# EasyEDA Pro project ProPrj_Filter_2024-12-27.epro

# Schematic Filter
Board Name: Filter; Create Date: 2024-12-21; Page Name: Filter; Project Name: Filter; Schematic Name: Filter; Update Date: 2024-12-21; Address1: *; Address2: *; Address3: *; Address4: *; Application_BuildNumber: *; ApprovedBy: *; Author: *; CheckedBy: *; CompanyName: *; CurrentDate: *; CurrentTime: *; Date: *; DocumentFullPathAndName: *; DocumentName: *; DocumentNumber: *; DrawnBy: *; Engineer: *; ImagePath: *; ModifiedDate: *; Organization: *; ProjectName: *; Revision: *; Rule: *; SPICEModelCacheQSZUGKFO: &lt;root&gt;  &lt;DocumentId&gt;QSZUGKFO&lt;/DocumentId&gt;&lt;/root&gt;; SheetNumber: 1; SheetTotal: 2; Time: *; Title: *
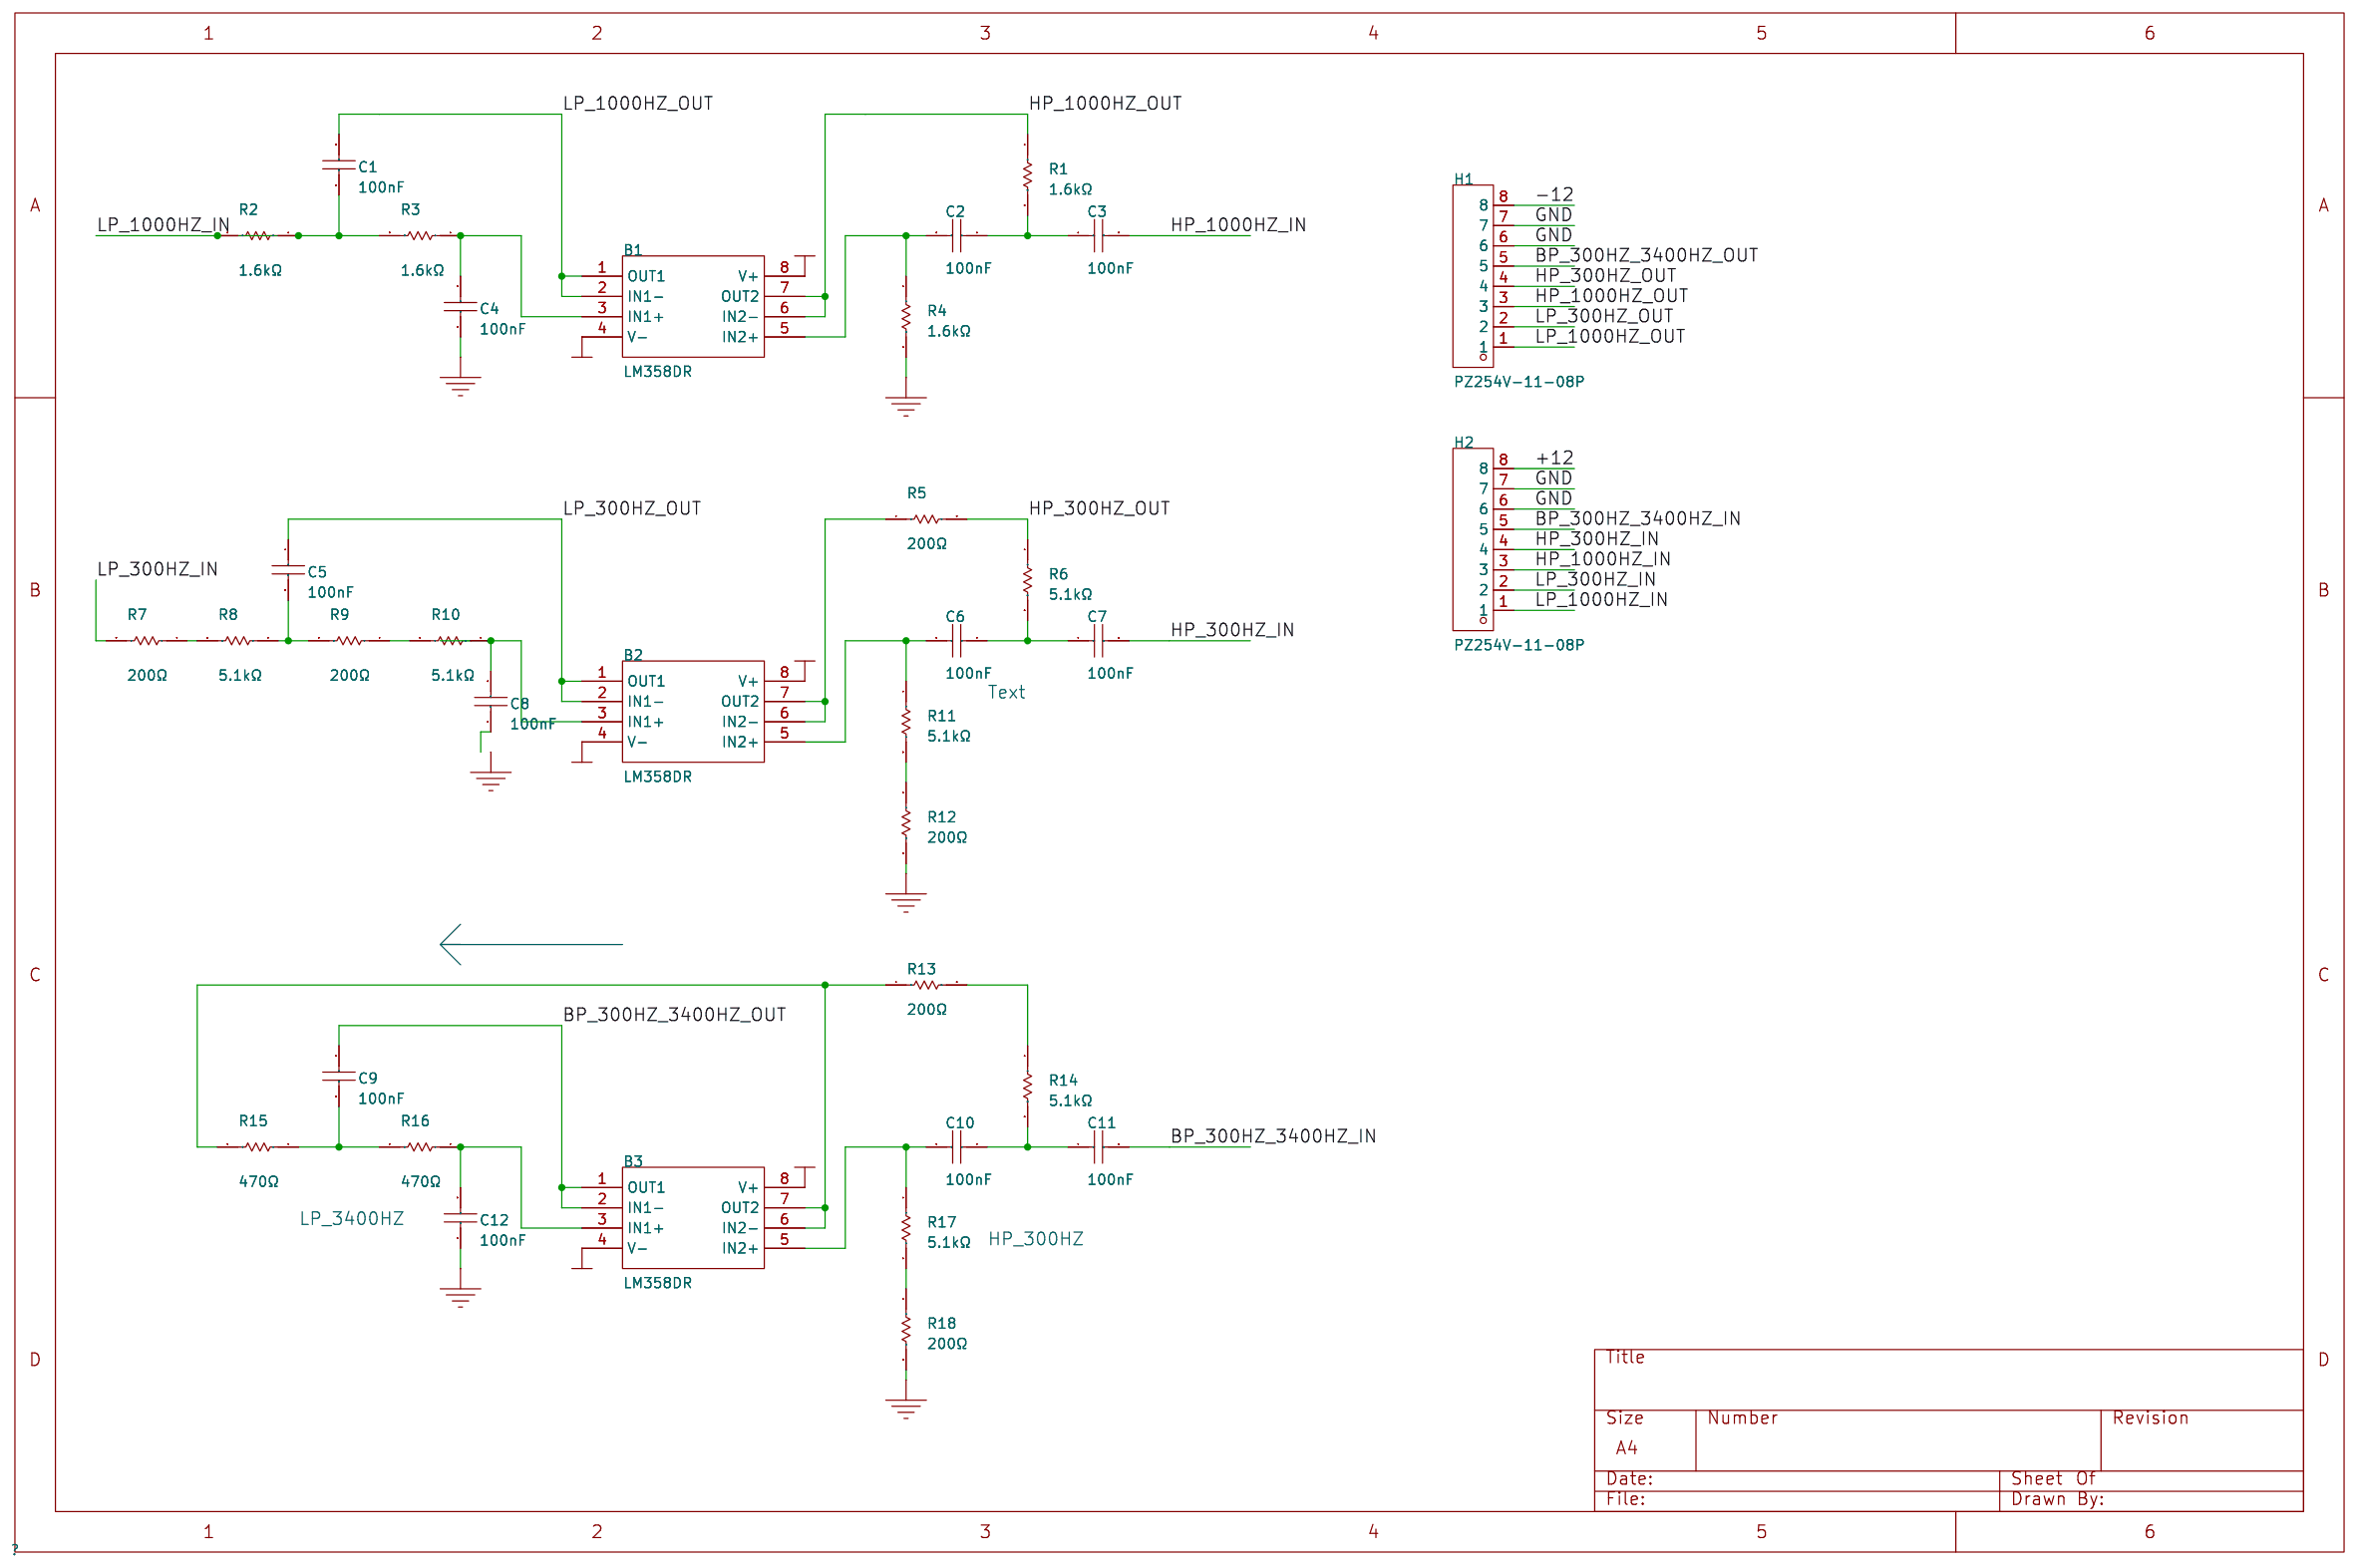
[diagram p0: schematic sheet]

## Parts
B1  LM358DR  [SOIC-8_L5.0-W4.0-P1.27-LS6.0-BL]
B2  LM358DR  [SOIC-8_L5.0-W4.0-P1.27-LS6.0-BL]
B3  LM358DR  [SOIC-8_L5.0-W4.0-P1.27-LS6.0-BL]
C1  100nF  [C0805]
C2  100nF  [C0805]
C3  100nF  [C0805]
C4  100nF  [C0805]
C5  100nF  [C0805]
C6  100nF  [C0805]
C7  100nF  [C0805]
C8  100nF  [C0805]
C9  100nF  [C0805]
C10  100nF  [C0805]
C11  100nF  [C0805]
C12  100nF  [C0805]
H1  PZ254V-11-08P  [HDR-TH_8P-P2.54-V-M]
H2  PZ254V-11-08P  [HDR-TH_8P-P2.54-V-M]
R1  1.6kΩ  [R0805]
R2  1.6kΩ  [R0805]
R3  1.6kΩ  [R0805]
R4  1.6kΩ  [R0805]
R5  200Ω  [R0805]
R6  5.1kΩ  [R0805]
R7  200Ω  [R0805]
R8  5.1kΩ  [R0805]
R9  200Ω  [R0805]
R10  5.1kΩ  [R0805]
R11  5.1kΩ  [R0805]
R12  200Ω  [R0805]
R13  200Ω  [R0805]
R14  5.1kΩ  [R0805]
R15  470Ω  [R0805]
R16  470Ω  [R0805]
R17  5.1kΩ  [R0805]
R18  200Ω  [R0805]

## Library data of the parts
B1-B3 = LM358DR: 放大器数:双路;增益带宽积(GBP):700kHz;压摆率(SR):0.3V/us;输入偏置电流(Ib):20nA;; LCSC Part Name: 行业标准双路运算放大器; Supplier Part: C5423; Manufacturer: TI(德州仪器); Supplier Footprint: SOIC-8; JLCPCB Part Class: Extended Part; Datasheet: https://www.ti.com/cn/lit/gpn/lm358; Supplier: LCSC; Number of Circuits: 双路; Gain Bandwidth Product(GBP): 700kHz; Slew Rate(SR): 0.3V/us; Current - Input Bias(Ib): 20nA; Quiescent Current: 1mA; Output Current: 40mA; Operating Temperature: 0℃~+70℃
C1-C12 = 0805B104J500NT: 容值:100nF;精度:±5%;额定电压:50V;材质(温度系数):X7R;; LCSC Part Name: 100nF ±5% 50V; Supplier Part: C29926; Manufacturer: FH(风华); Supplier Footprint: 0805; JLCPCB Part Class: Extended Part; Datasheet: https://atta.szlcsc.com/upload/public/pdf/source/20200305/C486355_26A10D38EF8C2A5C37091D0039909270.pdf; Supplier: LCSC; Tolerance: ±5%; Voltage Rated: 50V; Temperature Coefficient: X7R
H1 H2 = PZ254V-11-08P: 插针结构:1x8P;间距:2.54mm;行距:-;圆针/方针:方针;安装类型:直插;排数:单排;总PIN位数:8P;额定电流:-;额定电压:-;配合针长度:6mm;塑高:2.5mm;端接针长度:3mm;触头材质:黄铜;触头镀层:-;工作温度范围:-40℃~+105℃;颜色:黑色;; LCSC Part Name: 间距:2.54mm 1x8P 直插 方针; Supplier Part: C492407; Manufacturer: XFCN(兴飞); Supplier Footprint: 插件,P=2.54mm; JLCPCB Part Class: Extended Part; Datasheet: https://atta.szlcsc.com/upload/public/pdf/source/20200309/C492407_83A6FB26A2233368EDB9516968EC6149.pdf; Supplier: LCSC; Pin Structure: 1x8P; Pitch: 2.54mm; Circluar Pins/Square Pins: 方针; Mounting Type: 直插; Number of Rows: 单排; Number of Pins: 8P; Length of Mating Pin: 6mm; Insulation Height: 2.5mm; Length of End Connection Pin: 3mm; Contact Material: 黄铜; Operating Temperature Range: -40℃~+105℃; Color: 黑色
R1-R4 = FRC0805F1601TS: 电阻类型:厚膜电阻;阻值:1.6kΩ;精度:±1%;功率:125mW;最大工作电压:150V;温度系数:±100ppm/℃;; LCSC Part Name: 1.6kΩ ±1% 125mW 厚膜电阻; Supplier Part: C2933328; Manufacturer: FOJAN(富捷); Supplier Footprint: 0805; JLCPCB Part Class: Extended Part; Datasheet: https://atta.szlcsc.com/upload/public/pdf/source/20211221/925EC7D7225764EE0046F22065062C87.pdf; Supplier: LCSC; Type: 厚膜电阻; Tolerance: ±1%; Power(Watts): 125mW; Overload Voltage (Max): 150V; Temperature Coefficient: ±100ppm/℃; Operating Temperature Range: -55℃~+155℃
R5 R7 R9 R12 R13 R18 = 0805W8F2000T5E: 电阻类型:厚膜电阻;阻值:200Ω;精度:±1%;功率:125mW;最大工作电压:150V;温度系数:±100ppm/℃;; LCSC Part Name: 200Ω ±1% 125mW 厚膜电阻; Supplier Part: C17540; Manufacturer: UNI-ROYAL(厚声); Supplier Footprint: 0805; JLCPCB Part Class: Basic Part; Datasheet: https://atta.szlcsc.com/upload/public/pdf/source/20200306/C422600_1E6D84923E4A46A82E41ADD87F860B5C.pdf; Supplier: LCSC; Type: 厚膜电阻; Tolerance: ±1%; Power(Watts): 125mW; Overload Voltage (Max): 150V; Temperature Coefficient: ±100ppm/℃; Operating Temperature Range: -55℃~+155℃
R6 R8 R10 R11 R14 R17 = 0805W8F5101T5E: 电阻类型:厚膜电阻;阻值:5.1kΩ;精度:±1%;功率:125mW;最大工作电压:150V;温度系数:±100ppm/℃;; LCSC Part Name: 5.1kΩ ±1% 125mW 厚膜电阻; Supplier Part: C27834; Manufacturer: UNI-ROYAL(厚声); Supplier Footprint: 0805; JLCPCB Part Class: Basic Part; Datasheet: https://atta.szlcsc.com/upload/public/pdf/source/20200306/C422600_1E6D84923E4A46A82E41ADD87F860B5C.pdf; Supplier: LCSC; Type: 厚膜电阻; Tolerance: ±1%; Power(Watts): 125mW; Overload Voltage (Max): 150V; Temperature Coefficient: ±100ppm/℃; Operating Temperature Range: -55℃~+155℃
R15 R16 = FRC0805J471 TS: 电阻类型:厚膜电阻;阻值:470Ω;精度:±5%;功率:125mW;最大工作电压:150V;温度系数:±100ppm/℃;; LCSC Part Name: 470Ω ±5% 125mW 厚膜电阻; Supplier Part: C2907329; Manufacturer: FOJAN(富捷); Supplier Footprint: 0805; JLCPCB Part Class: Extended Part; Datasheet: https://atta.szlcsc.com/upload/public/pdf/source/20211221/925EC7D7225764EE0046F22065062C87.pdf; Supplier: LCSC; Type: 厚膜电阻; Tolerance: ±5%; Power(Watts): 125mW; Overload Voltage (Max): 150V; Temperature Coefficient: ±100ppm/℃; Operating Temperature Range: -55℃~+155℃

## Nets
GND: C4.1 C8.1 C12.1 H1.6 H1.7 H2.6 H2.7 R4.2 R12.2 R18.2
+12: B1.8(V+) B2.8(V+) B3.8(V+) H2.8
-12: B1.4(V-) B2.4(V-) B3.4(V-) H1.8
BP_300HZ_3400HZ_IN: C11.2 H2.5
BP_300HZ_3400HZ_OUT: B3.1(OUT1) B3.2(IN1-) C9.1 H1.5
HP_300HZ_IN: C7.2 H2.4
HP_300HZ_OUT: H1.4 R5.2 R6.1
HP_1000HZ_IN: C3.2 H2.3
HP_1000HZ_OUT: B1.6(IN2-) B1.7(OUT2) H1.3 R1.1
LP_300HZ_IN: H2.2 R7.2
LP_300HZ_OUT: B2.1(OUT1) B2.2(IN1-) C5.1 H1.2
LP_1000HZ_IN: C1.2 H2.1 R2.1 R2.2 R3.2
LP_1000HZ_OUT: B1.1(OUT1) B1.2(IN1-) C1.1 H1.1
$1N2: B1.3(IN1+) C4.2 R3.1
$1N7: C2.1 C3.1 R1.2
$1N9: B1.5(IN2+) C2.2 R4.1
$1N12: B2.3(IN1+) C8.2 R10.1
$1N17: C6.1 C7.1 R6.2
$1N19: B2.5(IN2+) C6.2 R11.1
$1N22: B3.3(IN1+) C12.2 R16.1
$1N24: R17.2 R18.1
$1N26: C10.1 C11.1 R14.2
$1N28: B3.5(IN2+) C10.2 R17.1
$1N2608: C9.2 R15.1 R16.2
$1N2619: B3.6(IN2-) B3.7(OUT2) R13.1 R15.2
$1N2647: R13.2 R14.1
$1N2735: R11.2 R12.1
$1N2855: B2.6(IN2-) B2.7(OUT2) R5.1
$1N2901: R7.1 R8.2
$1N2936: R9.1 R10.2
$1N2941: C5.2 R8.1 R9.2

## Notes on the sheet
- Text
- LP_3400HZ
- HP_300HZ

# Board PCB1
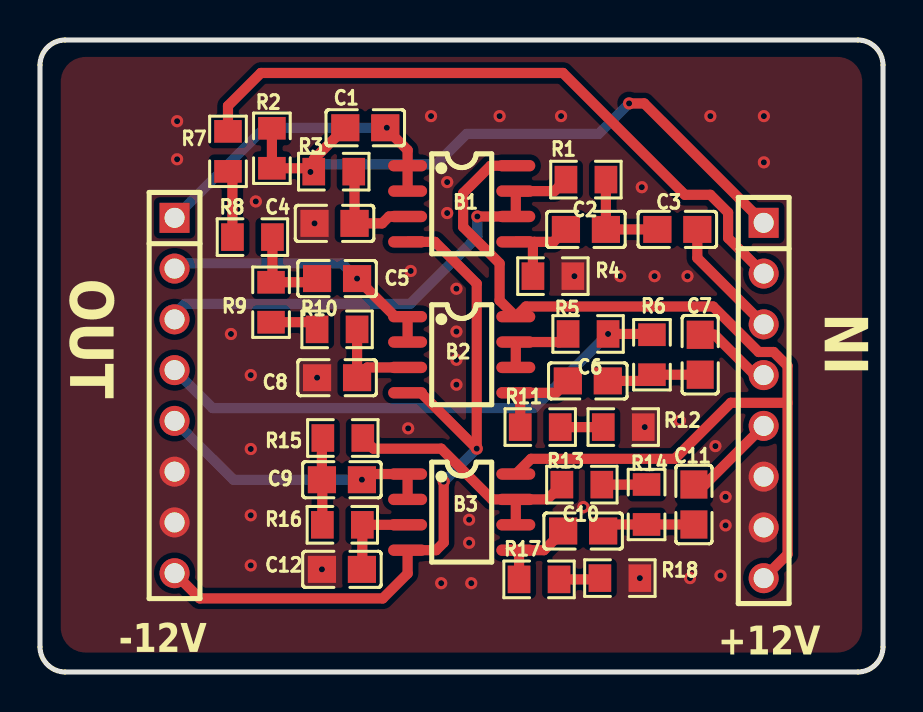
[diagram p1: board, top side]
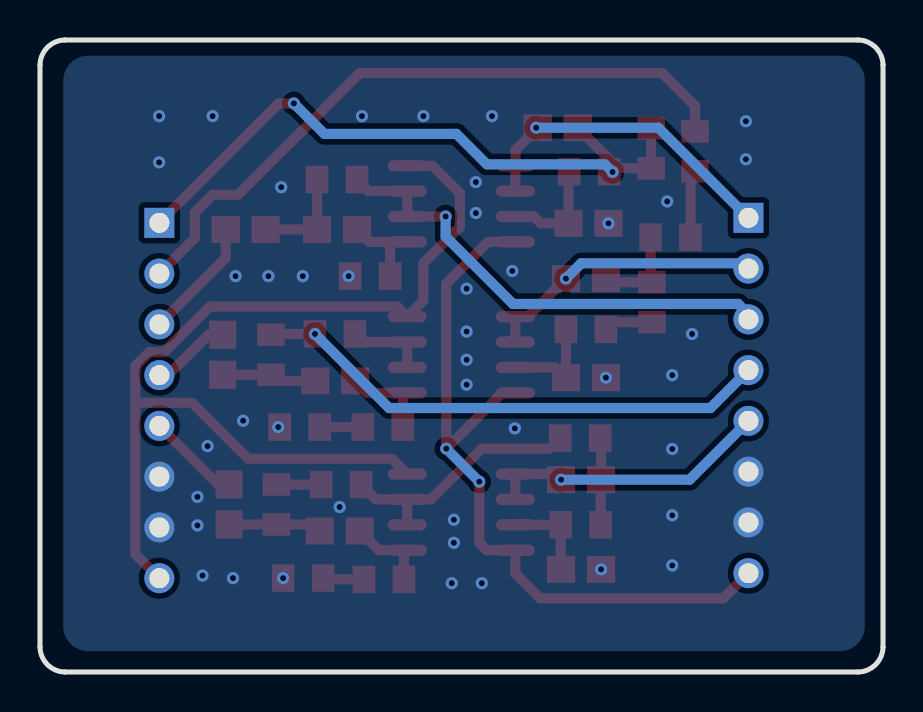
[diagram p2: board, bottom side, seen from below]

Outline 42.16 x 31.62 mm; copper layers: Top Layer, Bottom Layer. Coordinates in mm from the lower left corner of the outline.
Outline path: 0,30.35 0,1.27 arc(0.37,0.37) 1.27,0 40.89,0 arc(41.79,0.37) 42.16,1.27 42.16,30.35 arc(41.79,31.25) 40.89,31.62 1.27,31.62 arc(0.37,31.25) 0,30.35
Stack: Top Layer 0.035mm / Dielectric1 1.51mm FR4 er 4.5 / Bottom Layer 0.035mm

## Design rules (mm)
template: 自定义配置
spacing copperThickness1oz (default): track to track 0.102, other pairs 0.152 to 0.3
spacing copperThickness2oz: track to track 0.203, other pairs 0.152 to 0.3
track width copperThickness1oz (default): min 0.127, default 0.254, max 2.54
track width copperThickness2oz: min 0.203, default 0.254, max 2.54
differential pair differentialPair (default): width min 0.127, default 0.254, max 2.54; gap min 0.152, default 0.152
via viaSize (default): diameter min 0.5, default 0.61, max 10; hole min 0.3, default 0.305, max 6.3

## Placement (name value [footprint] x y rotation side)
B1  LM358DR  [SOIC-8_L5.0-W4.0-P1.27-LS6.0-BL]  21.09 23.43 270 top
B2  LM358DR  [SOIC-8_L5.0-W4.0-P1.27-LS6.0-BL]  21.09 15.88 270 top
B3  LM358DR  [SOIC-8_L5.0-W4.0-P1.27-LS6.0-BL]  21.09 8 270 top
C1  100nF  [C0805]  16.27 27.23 180 top
C2  100nF  [C0805]  27.31 22.14 180 top
C3  100nF  [C0805]  31.88 22.14 0 top
C4  100nF  [C0805]  14.73 22.45 0 top
C5  100nF  [C0805]  14.86 19.69 180 top
C6  100nF  [C0805]  27.4 14.56 180 top
C7  100nF  [C0805]  33.02 15.88 90 top
C8  100nF  [C0805]  14.86 14.73 0 top
C9  100nF  [C0805]  15.1 9.62 180 top
C10  100nF  [C0805]  27.17 7.06 180 top
C11  100nF  [C0805]  32.71 8.38 90 top
C12  100nF  [C0805]  15.1 5.14 0 top
H1  PZ254V-11-08P  [HDR-TH_8P-P2.54-V-M]  6.73 13.84 270 top
H2  PZ254V-11-08P  [HDR-TH_8P-P2.54-V-M]  36.2 13.59 270 top
R1  1.6kΩ  [R0805]  27.31 24.64 0 top
R2  1.6kΩ  [R0805]  11.6 26.2 270 top
R3  1.6kΩ  [R0805]  14.69 25.03 180 top
R4  1.6kΩ  [R0805]  25.65 19.81 0 top
R5  200Ω  [R0805]  27.41 16.91 0 top
R6  5.1kΩ  [R0805]  30.61 15.88 270 top
R7  200Ω  [R0805]  9.4 26.05 90 top
R8  5.1kΩ  [R0805]  10.63 21.76 180 top
R9  200Ω  [R0805]  11.56 18.5 90 top
R10  5.1kΩ  [R0805]  14.86 17.14 180 top
R11  5.1kΩ  [R0805]  25.02 12.25 0 top
R12  200Ω  [R0805]  29.17 12.25 0 top
R13  200Ω  [R0805]  27.1 9.38 0 top
R14  5.1kΩ  [R0805]  30.34 8.38 270 top
R15  470Ω  [R0805]  15.15 11.71 0 top
R16  470Ω  [R0805]  15.12 7.37 180 top
R17  5.1kΩ  [R0805]  24.96 4.63 0 top
R18  200Ω  [R0805]  29 4.7 0 top

## Footprints (pads in the part's own frame, mm; a bottom-side part is the same pattern mirrored in y, then rotated)
C0805
  rect 1.41x1.35 smd: 1(-1,0) 2(1,0)
HDR-TH_8P-P2.54-V-M
  rect 1.5x1.5 hole 1: 1(-8.89,0)
  round 1.5 hole 1: 2(-6.35,0) 3(-3.81,0) 4(-1.27,0) 5(1.27,0) 6(3.81,0) 7(6.35,0) 8(8.89,0)
R0805
  rect 1.133x1.377 smd: 1(-1,0) 2(1,0)
SOIC-8_L5.0-W4.0-P1.27-LS6.0-BL
  oval 0.569x1.95 smd: 1(-1.905,-2.705) 2(-0.635,-2.705) 3(0.635,-2.705) 4(1.905,-2.705) 5(1.905,2.705) 6(0.635,2.705) 7(-0.635,2.705) 8(-1.905,2.705)

## Nets
As in the schematic.

## Via types
v1: diameter 0.61, hole 0.305, Top Layer to Bottom Layer, 52 vias

## Routing (per net, layer and track width the routed paths; a pad name or vN(x,y) marks a point on that pad's centre or on a via; arc(x,y) is an arc through that point)
GND:
  vias: v1(6.86,27.56) v1(6.86,25.65) v1(9.55,16.91) v1(10.54,14.85) v1(10.54,11.16) v1(10.54,7.84) v1(10.54,5.33) v1(10.8,23.54) v1(13.73,22.45) v1(13.86,14.73) v1(14.1,5.14) v1(18.42,12.19) v1(18.54,20.07) v1(19.56,27.81) v1(20.07,4.45) v1(20.37,24.51) v1(20.37,22.96) v1(20.83,19.18) v1(20.83,17.04) v1(20.83,15.62) v1(20.83,14.38) v1(21.46,7.62) v1(21.46,6.47) v1(21.57,4.45) v1(22.99,27.81) v1(26.06,27.81) v1(26.73,19.81) v1(27.18,8.26) v1(29.02,19.81) v1(30,4.7) v1(30.1,24.26) v1(30.25,12.25) v1(30.74,19.81) v1(32,12.57) v1(32.38,19.81) v1(32.51,4.7) v1(33.53,27.81) v1(33.78,11.3) v1(34.04,4.83) v1(34.29,8.76) v1(34.29,7.34) v1(36.21,27.81) v1(36.21,25.5)
+12: length 51.7
  Top Layer w0.508: H2.8 37.39,5.89 37.39,13.47 ; 37.39,13.47 34.55,13.47 31.75,10.67 24.56,10.67 B3.8 ; 37.39,13.47 37.39,15.31 36.69,16.01 35.94,16.01 33.67,18.29 24.31,18.29 B2.8 22.99,18.59 22.99,20.45 21.16,22.27 21.16,23.96 22.54,25.33 B1.8
-12: length 38.4
  Top Layer w0.508: B1.4 19.75,21.52 21.84,19.43 v1(21.84,11.18) 19.05,13.97 B2.4 ; H1.8 7.99,3.68 17.15,3.68 18.39,4.92 B3.4 19.81,6.1 20.19,6.48 v1(20.19,9.53)
  Bottom Layer w0.508: v1(21.84,11.18) v1(20.19,9.53)
BP_300HZ_3400HZ_IN: length 4.7
  Top Layer w0.508: 36.2,12.31 33.26,9.38 C11.2
BP_300HZ_3400HZ_OUT: length 14.3
  Top Layer w0.508: B3.2 B3.1 16.39,9.91 v1(16.1,9.62)
  Bottom Layer w0.508: H1.5 9.67,9.62 v1(16.1,9.62)
HP_300HZ_IN: length 4
  Top Layer w0.508: H2.4 35.76,14.86 33.74,16.88 C7.2
HP_300HZ_OUT: length 26.2
  Top Layer w0.508: R6.1 30.57,16.91 v1(28.41,16.91)
  Bottom Layer w0.508: H1.4 8.63,13.21 24.71,13.21 v1(28.41,16.91)
HP_1000HZ_IN: length 6.1
  Top Layer w0.508: C3.2 32.88,20.71 36.2,17.39
HP_1000HZ_OUT: length 24
  Top Layer w0.508: R1.1 25.73,24.06 B1.7 B1.6 v1(21.88,22.79)
  Bottom Layer w0.508: v1(21.88,22.79) 21.88,21.78 18.51,18.42 7.24,18.42 6.73,17.91 H1.3
LP_300HZ_IN: length 33.7
  Top Layer w0.508: R7.2 9.4,28.33 11.05,29.97 26.16,29.97 32.25,23.88 33.53,23.88 34.42,22.99 34.42,21.71 H2.2
LP_300HZ_OUT: length 14.1
  Top Layer w0.508: B2.2 B2.1 17.76,17.78 v1(15.86,19.69)
  Bottom Layer w0.508: v1(15.86,19.69) 15.1,20.45 6.99,20.45 H1.2
LP_1000HZ_IN: length 33.6
  Top Layer w0.508: H2.1 30.22,28.45 v1(29.46,28.45) ; R2.1 R2.2 13.52,25.2 R3.2 13.69,25.66 C1.2
  Bottom Layer w0.508: v1(29.46,28.45) 27.94,26.92 21.34,26.92 19.81,25.4 13.91,25.4 v1(13.53,25.02)
LP_1000HZ_OUT: length 16.1
  Top Layer w0.508: B1.2 B1.1 18.39,26.11 C1.1
  Bottom Layer w0.508: v1(17.35,27.23) 11.24,27.23 H1.1
$1N2: length 5.4
  Top Layer w0.508: B1.3 17.46,22.79 17.11,22.45 C4.2 15.73,25 R3.1
$1N7: length 5.1
  Top Layer w0.508: R1.2 C2.1 C3.1
$1N9: length 4.5
  Top Layer w0.508: 24.73,21.52 B1.5 ; 24.73,21.52 25.68,21.52 C2.2 ; 24.73,21.52 24.65,21.45 R4.1
$1N12: length 5.2
  Top Layer w0.508: R10.1 C8.2 16.37,15.24 B2.3
$1N17: length 4.7
  Top Layer w0.508: C6.1 30.3,14.56 R6.2 C7.1
$1N19: length 4.6
  Top Layer w0.508: 24.1,13.97 24.02,13.89 R11.1 ; 24.1,13.97 25.81,13.97 C6.2 ; 24.1,13.97 B2.5
$1N22: length 4.5
  Top Layer w0.508: C12.2 16.12,5.16 R16.1 B3.3
$1N24: length 2.1
  Top Layer w0.508: R18.1 27.94,4.63 R17.2
$1N26: length 4.7
  Top Layer w0.508: C10.1 28.49,7.38 R14.2 C11.1
$1N28: length 4.3
  Top Layer w0.508: R17.1 23.96,5.93 B3.5 25.21,6.1 C10.2
$1N2608: length 4.4
  Top Layer w0.508: R16.2 14.12,9.6 C9.2 14.1,11.66 R15.1
$1N2619: length 12.8
  Top Layer w0.508: R13.1 25.36,8.64 B3.7 ; B3.7 22.61,8.64 20.07,11.18 16.68,11.18 R15.2 ; B3.7 B3.6
$1N2647: length 2.2
  Top Layer w0.508: R13.2 30.33,9.38 R14.1
$1N2735: length 2.2
  Top Layer w0.508: R12.1 R11.2
$1N2855: length 4.1
  Top Layer w0.508: B2.6 B2.7 26.01,16.51 R5.1
$1N2901: length 3.4
  Top Layer w0.508: R8.2 9.63,24.83 R7.1
$1N2936: length 2.4
  Top Layer w0.508: R9.1 13.5,17.5 R10.2
$1N2941: length 4.7
  Top Layer w0.508: C5.2 13.68,19.5 R9.2 11.63,19.57 R8.1

## Copper pours and planes (outline as drawn; the poured copper is in the pictures)
GND on Top Layer: 1.01,29.53 1.03,29.73 1.09,29.95 1.18,30.15 1.31,30.34 1.47,30.5 1.66,30.63 1.87,30.73 2.09,30.78 2.28,30.8 39.88,30.8 40.08,30.78 40.3,30.73 40.51,30.63 40.69,30.5 40.85,30.34 40.98,30.15 41.08,29.95 41.13,29.73 41.15,29.53 41.15,2.22 41.13,2.02 41.08,1.8 40.98,1.6 40.85,1.41 40.69,1.25 40.51,1.12 40.3,1.02 40.08,0.97 39.88,0.95 2.28,0.95 2.09,0.97 1.87,1.02 1.66,1.12 1.47,1.25 1.31,1.41 1.18,1.6 1.09,1.8 1.03,2.02 1.01,2.22
GND on Bottom Layer: 0.89,29.59 0.9,29.79 0.96,30.01 1.05,30.22 1.18,30.4 1.35,30.57 1.53,30.7 1.74,30.79 1.96,30.85 2.16,30.86 39.75,30.86 39.95,30.85 40.17,30.79 40.38,30.7 40.57,30.57 40.73,30.4 40.86,30.22 40.95,30.01 41.01,29.79 41.02,29.59 41.02,2.29 41.01,2.09 40.95,1.87 40.86,1.66 40.73,1.47 40.57,1.31 40.38,1.18 40.17,1.09 39.95,1.03 39.75,1.02 2.16,1.02 1.96,1.03 1.74,1.09 1.53,1.18 1.35,1.31 1.18,1.47 1.05,1.66 0.96,1.87 0.9,2.09 0.89,2.29

## Text on the board
Top Silkscreen Layer: -12V | +12V | IN | OUT
